# EAGLE design WheelSensor (EAGLE 4.16)
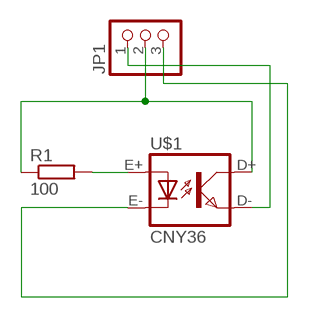
[diagram p0: schematic, sheet 1]

## Parts
JP1  PINHD-1X3  [1X03]
R1  100  R-EU_0207/12  [0207/12]
U$1  CNY36  [CNY36]

## Nets
N$1: R1.2 U$1.E+
N$2: JP1.3 U$1.E-
N$3: JP1.2 R1.1 U$1.D+
N$4: JP1.1 U$1.D-

## Library data of the parts
JP1 = pinhead:PINHD-1X3: PIN HEADER
R1 = rcl:R-EU_: RESISTOR, European symbol
U$1 = cny36:CNY36

## Board
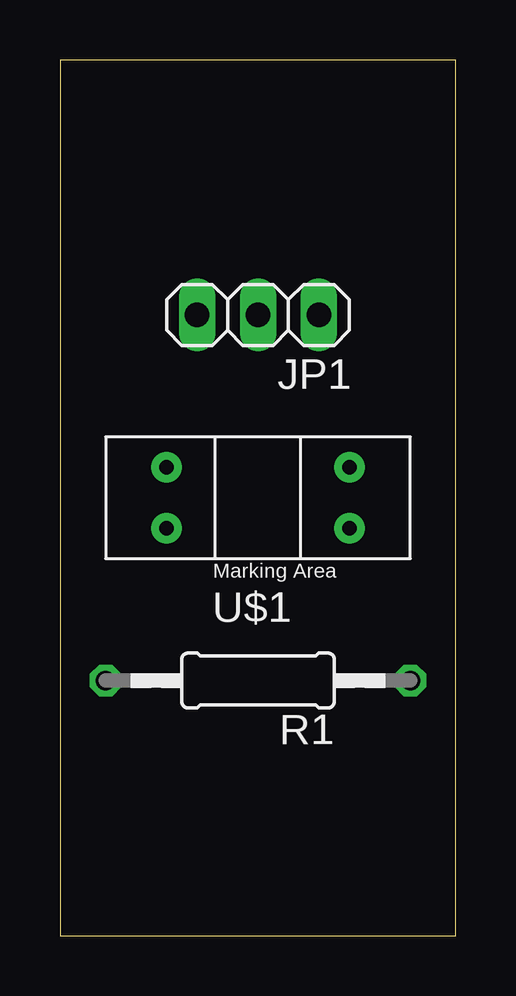
[diagram p1: board, top side]
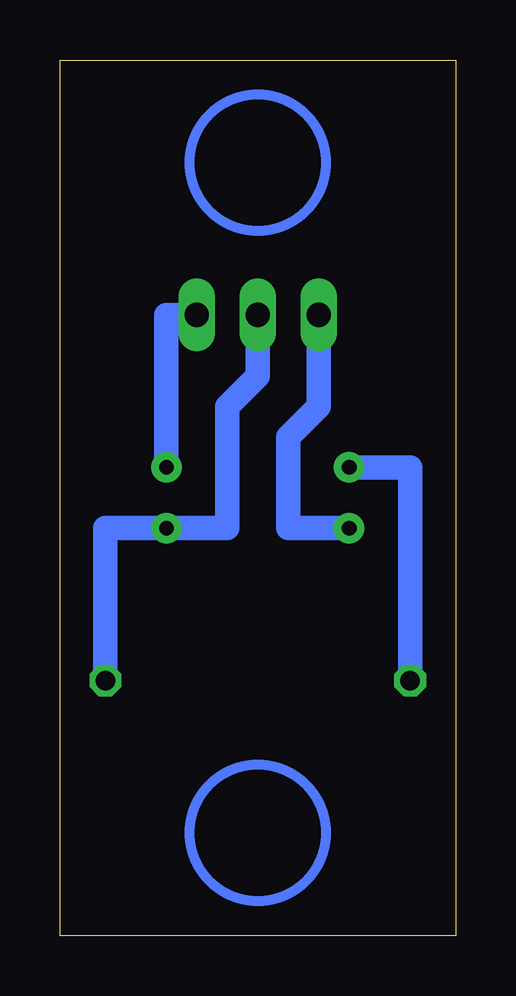
[diagram p2: board, bottom side, seen from below]

Size 16.49 x 36.5 mm. Coordinates in mm from the lower left corner, seen from the top.
Outline: 0,0 16.49,0 16.49,36.5 0,36.5 0,0
Copper layers (1*16): Top 0.035mm / dielectric 1.5mm / Bottom 0.035mm
Design rules "default": minimum track width 10mil, minimum drill 24mil, track to track 8mil, track to pad 8mil, pad to pad 8mil, via to via 8mil, smd to smd 8mil, copper to edge 40mil, drill to drill 8mil, minimum pad ring 10mil, minimum via ring 8mil, stop-mask expansion 4mil, vias tented up to drill 0mil, thermal gap 10mil

### Footprints (pad centres in the part's own frame; a part is rotated, then mirrored left to right if it is on the bottom)
1X03 = drill 1.016 long: 1 -2.54,0; 2 0,0; 3 2.54,0
0207/12 = drill 0.813 octagon: 1 -6.35,0; 2 6.35,0
CNY36 = drill 0.61 pad 1.27 round: D+ -5.08,0; D- -5.08,-2.54; E+ 2.54,-2.54; E- 2.54,0

### Placement (x,y rotation side)
JP1  8.25,25.87 180 top
R1  8.25,10.63 180 top
U$1  6.98,16.98 180 top

### Tracks (layer width: path | path; a pad name or v marks a point on that pad's centre or on a via)
N$1
  Bottom 1.016: R1.2 1.9,19.52 U$1.E+
N$2
  Bottom 1.016: JP1.3 5.71,22.06 6.98,20.79 6.98,16.98 U$1.E-
N$3
  Bottom 1.016: R1.1 14.6,16.98 U$1.D+ 9.52,16.98 9.52,22.06 8.25,23.33 JP1.2
N$4
  Bottom 1.016: JP1.1 12.06,25.87 U$1.D-
(copper drawn outside any net)
  shapes: Bottom circle x2